# Altium schematic sheet SOLAR_PO.SchDoc
size A2; SheetNumber: 5; SheetTotal: 5
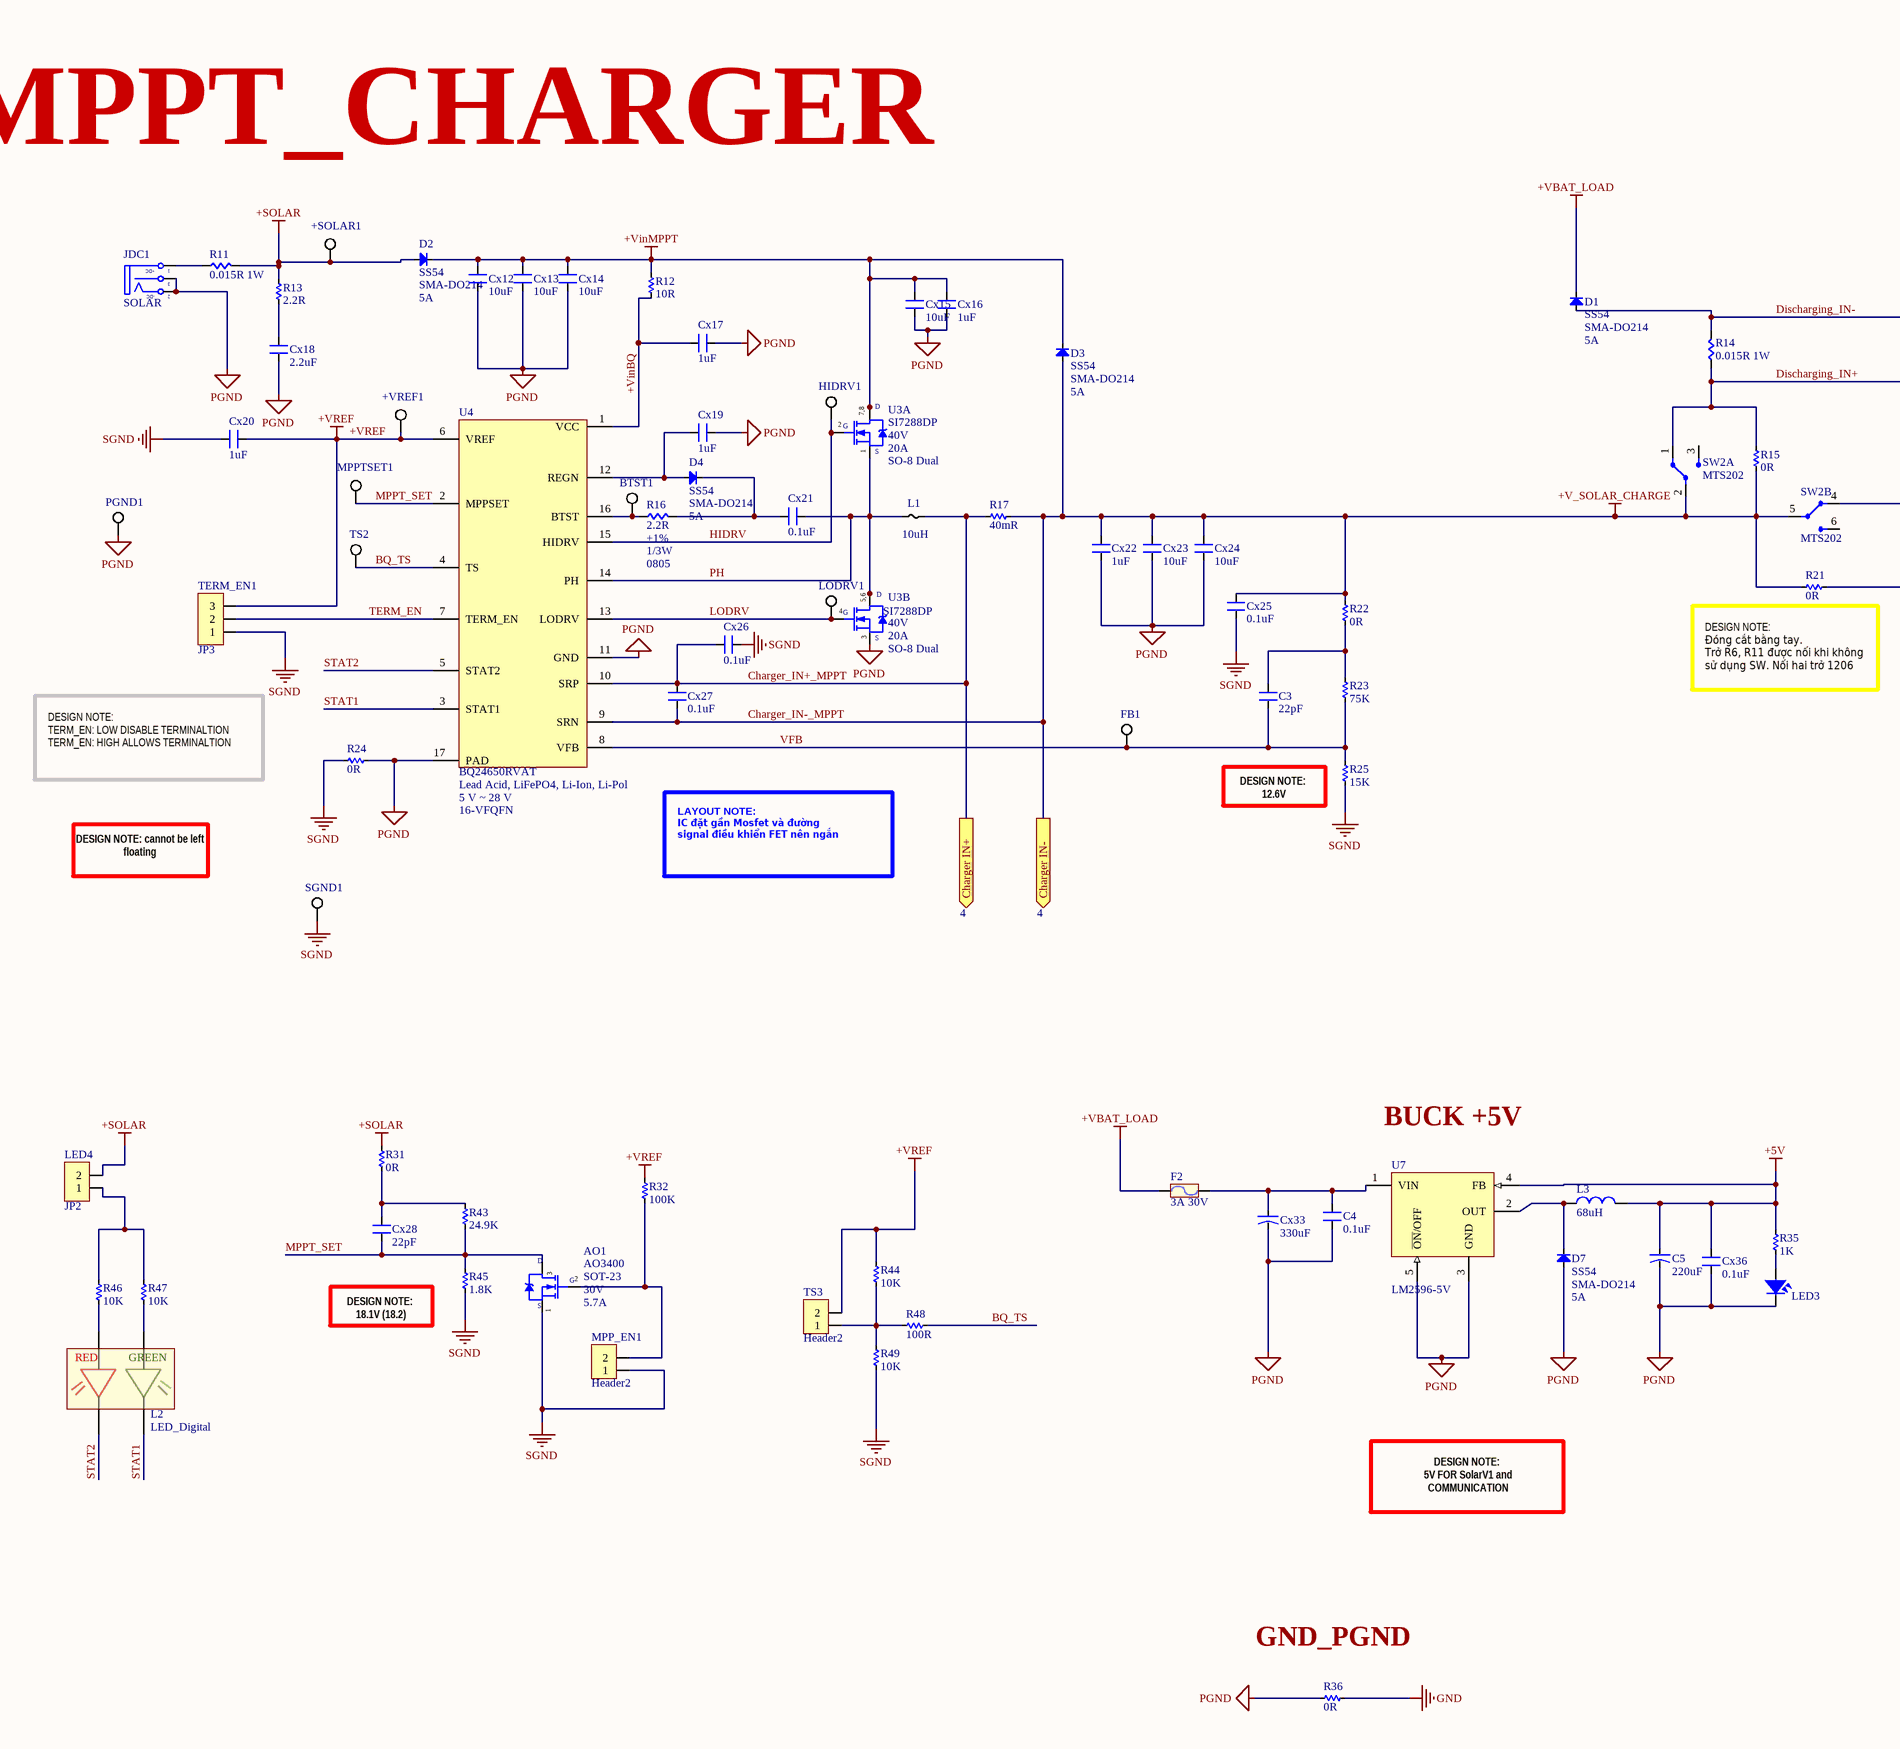
[diagram p0: SOLAR_PO.SchDoc, left]
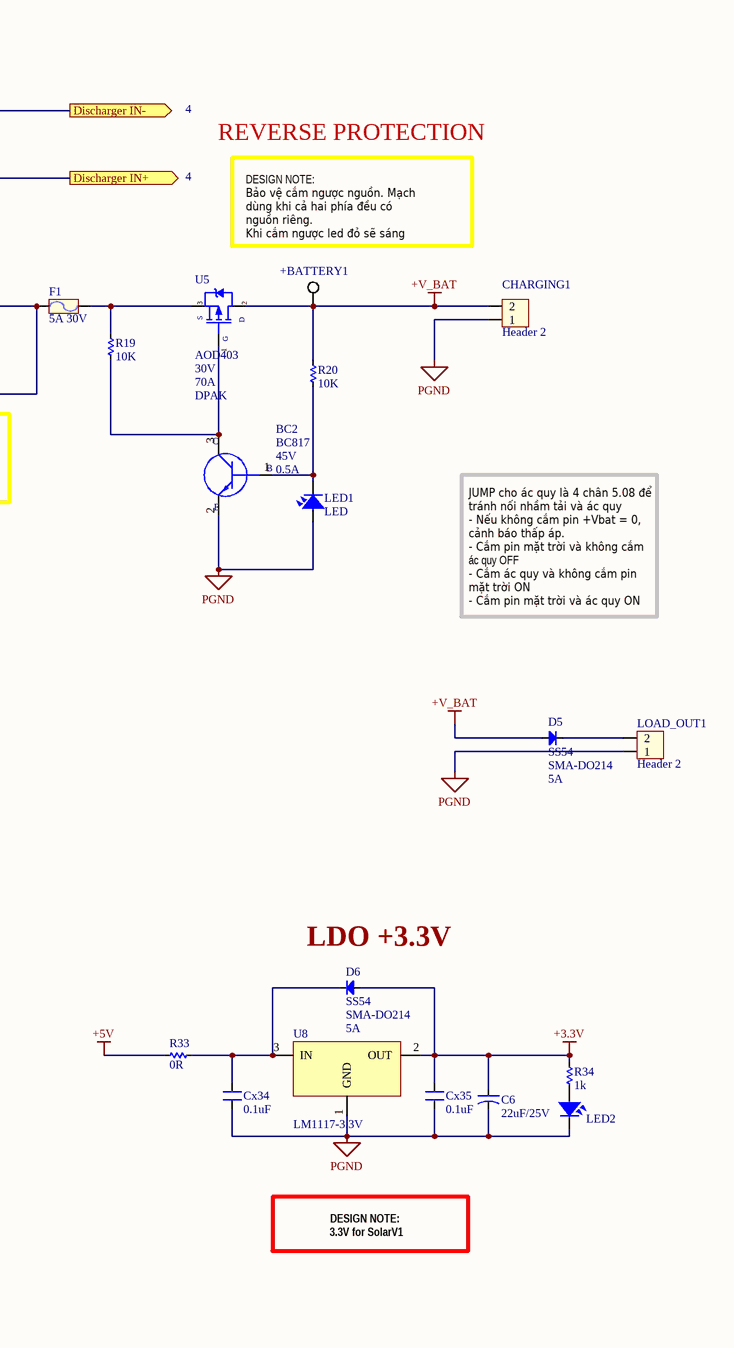
[diagram p1: SOLAR_PO.SchDoc, right]

## Parts
+BATTERY1  TP 2x2mm  [TP 2x2mm]  (value not drawn)
+SOLAR1  TP 2x2mm  [TP 2x2mm]  (value not drawn)
+VREF1  TP 2x2mm  [TP 2x2mm]  (value not drawn)
AO1  AO3400  Package Type: SOT-23  Drain-Source On-Volt: 30V  Continuous Drain Current: 5.7A  [SOT23-231]
BC2  BC817  Voltage: 45V  Current: 0.5A  [SOT23-132]
BTST1  TP 2x2mm  [TP 2x2mm]  (value not drawn)
C3  22pF  [SM-0805]
C4  0.1uF  [SM-0805]
C5  220uF  [CAP-ALU-SMD-F]
C6  22uF/25V  [CAP-ALU-SMD-4.5x5x1.4]
CHARGING1  Header 2  [HED2T]
Cx12  10uF  [CN-SMD-0805]
Cx13  10uF  [CN-SMD-0805]
Cx14  10uF  [CN-SMD-0805]
Cx15  10uF  [CN-SMD-0805]
Cx16  1uF  [CN-SMD-0805]
Cx17  1uF  [CN-SMD-0805]
Cx18  2.2uF  [CN-SMD-0805]
Cx19  1uF  [CN-SMD-0805]
Cx20  1uF  [CN-SMD-0805]
Cx21  0.1uF  [CN-SMD-0805]
Cx22  1uF  [CN-SMD-0805]
Cx23  10uF  [CN-SMD-0805]
Cx24  10uF  [CN-SMD-0805]
Cx25  0.1uF  [CN-SMD-0805]
Cx26  0.1uF  [CN-SMD-0805]
Cx27  0.1uF  [CN-SMD-0805]
Cx28  22pF  [CN-SMD-0805]
Cx33  330uF  [CAP SMD ALU SIZE F]
Cx34  0.1uF  [CN-SMD-0805]
Cx35  0.1uF  [CN-SMD-0805]
Cx36  0.1uF  [CN-SMD-0805]
D1  SS54  Package: SMA-DO214  Current: 5A  [SMA (DO-214AC)]
D2  SS54  Package: SMA-DO214  Current: 5A  [SMA (DO-214AC)]
D3  SS54  Package: SMA-DO214  Current: 5A  [SMA (DO-214AC)]
D4  SS54  Package: SMA-DO214  Current: 5A  [SMA (DO-214AC)]
D5  SS54  Package: SMA-DO214  Current: 5A  [SMA (DO-214AC)]
D6  SS54  Package: SMA-DO214  Current: 5A  [SMA (DO-214AC)]
D7  SS54  Package: SMA-DO214  Current: 5A  [SMA (DO-214AC)]
F1  5A 30V  [CN4]
F2  3A 30V  [CN2-G]
FB1  TP 2x2mm  [TP 2x2mm]  (value not drawn)
HIDRV1  TP 2x2mm  [TP 2x2mm]  (value not drawn)
JDC1  SOLAR  [DC0]
L1  10uH  [CDRH104R]
L2  LED_Digital  [LedDigital]
L3  68uH  [INDUCTOR SMD 12x12X8.5mm]
LED1  LED  [LED-5 GRe]
LED2  LED  [LED-0805-Blue]  (value not drawn)
LED3  LED  [LED-0805-Red]  (value not drawn)
LED4  JP2  [JP2-CLOSED]
LOAD_OUT1  Header 2  [HED2T]
LODRV1  TP 2x2mm  [TP 2x2mm]  (value not drawn)
MPP_EN1  Header2  [JP2-D1T]
MPPTSET1  TP 2x2mm  [TP 2x2mm]  (value not drawn)
PGND1  TP 2x2mm  [TP 2x2mm]  (value not drawn)
R11  0.015R 1W  [RES-SMD-2512]
R12  10R  [RES-SMD-0805]
R13  2.2R  [RES-SMD-2512]
R14  0.015R 1W  [RES-SMD-2512]
R15  0R  [RES-SMD-1206]
R16  2.2R  Tolerance: ±1%  Power (Watts): 1/3W  Supplier Device Package: 0805  [RES-SMD-0805]
R17  40mR  [RES-SMD-2512]
R19  10K  [RES-SMD-0805]
R20  10K  [RES-SMD-0805]
R21  0R  [RES-SMD-1206]
R22  0R  [RES-SMD-0805]
R23  75K  [RES-SMD-0805]
R24  0R  [RES-SMD-0805]
R25  15K  [RES-SMD-0805]
R31  0R  [RES-SMD-0805]
R32  100K  [RES-SMD-0805]
R33  0R  [RES-SMD-0805]
R34  1k  [RES-SMD-0805]
R35  1K  [RES-SMD-0805]
R36  0R  [RES-SMD-0805]
R43  24.9K  [RES-SMD-0805]
R44  10K  [RES-SMD-0805]
R45  1.8K  [RES-SMD-0805]
R46  10K  [RES-SMD-0805]
R47  10K  [RES-SMD-0805]
R48  100R  [RES-SMD-0805]
R49  10K  [RES-SMD-0805]
SGND1  TP 2x2mm  [TP 2x2mm]  (value not drawn)
SW2  MTS202  [MTS-20X]  (parts A,B of 2)
TERM_EN1  JP3  [JP3-D1T]
TS2  TP 2x2mm  [TP 2x2mm]  (value not drawn)
TS3  Header2  [JP2-D1T]
U3  SI7288DP  Drain to Source Voltage (Vdss): 40V  Current - Continuous Drain (Id) @ 25°C: 20A  Package / Case: SO-8 Dual  [SO-8 PowerPAK]  (parts A,B of 2)
U4  BQ24650RVAT  Battery Chemistry: Lead Acid, LiFePO4, Li-Ion, Li-Pol  Voltage - Supply: 5 V ~ 28 V  Package / Case: 16-VFQFN  [VFQFN-16-EP]
U5  AOD403  Drain-Source On-Volt: 30V  Continuous Drain Current: 70A  Package Type: DPAK  [TO-252 DPAK]
U7  LM2596-5V  [TO263]
U8  LM1117-3.3V  [SOT223]

## Ports
Charger IN+ (out), Charger IN- (out), Discharger IN+ (out), Discharger IN- (out)

## Nets
+3.3V: C6.1 Cx35.2 D6.1(A) R34.1 U8.2(OUT)
+5V: C5.1 Cx36.2 L3.2 R33.2 R35.1 U7.4(FB)
+SOLAR: +SOLAR1.3 D2.1(A) LED4.2 R11.2 R13.1 R31.1
+V_BAT: +BATTERY1.3 CHARGING1.2 D5.1(A) R20.2 U5.2(D)
+VBAT_LOAD: D1.2(K) F2.1
+VinMPPT: Cx12.2 Cx13.2 Cx14.2 Cx15.2 Cx16.1 D2.2(K) D3.2(K) R12.1 U3.7(D) U3.8(D)
+VREF: +VREF1.3 Cx20.1 R32.1 R44.1 TERM_EN1.3 TS3.2 U4.6(VREF)
Charger_IN-_MPPT: Cx22.1 Cx23.1 Cx24.2 Cx25.1 Cx27.2 D3.1(A) R15.1 R17.1 R21.1 R22.1 SW2.2 SW2.5 U4.9(SRN) ; port Charger IN-  [also labelled +V_SOLAR_CHARGE]
GND: R36.1
PGND: BC2.2(E) C4.1 C5.2 C6.2 CHARGING1.1 Cx12.1 Cx13.1 Cx14.1 Cx15.1 Cx16.2 Cx17.1 Cx18.1 Cx19.1 Cx22.2 Cx23.2 Cx24.1 Cx33.2 Cx34.1 Cx35.1 Cx36.1 D7.1(A) JDC1.2(TN) JDC1.3(S) LED1.1 LED2.2 LED3.2 LOAD_OUT1.1 PGND1.3 R24.1 R36.2 U3.3(S) U4.11(GND) U4.17(PAD) U7.3(GND) U7.5(~{ON}/OFF) U8.1(GND)
SGND: AO1.1(S) Cx20.2 Cx25.2 Cx26.1 MPP_EN1.1 R24.2 R25.2 R45.2 R49.2 SGND1.3 TERM_EN1.1
+VinBQ: Cx17.2 R12.2 U4.1(VCC)
BQ_TS: R48.2 TS2.3 U4.4(TS)
Charger_IN+_MPPT: Cx26.2 Cx27.1 L1.2 R17.2 U4.10(SRP) ; port Charger IN+
Discharging_IN+: R14.1 R15.2 SW2.1 ; port Discharger IN+
Discharging_IN-: D1.1(A) R14.2 ; port Discharger IN-
HIDRV: HIDRV1.3 U3.2(G) U4.15(HIDRV)
LODRV: LODRV1.3 U3.4(G) U4.13(LODRV)
MPPT_SET: AO1.3(D) Cx28.2 MPPTSET1.3 R43.2 R45.1 U4.2(MPPSET)
PH: Cx21.1 L1.1 U3.1(S) U3.5(D) U3.6(D) U4.14(PH)
STAT1: L2.4 U4.3(STAT1)
STAT2: L2.2 U4.5(STAT2)
TERM_EN: TERM_EN1.2 U4.7(TERM_EN)
VFB: C3.1 FB1.3 R23.2 R25.1 U4.8(VFB)
NetAO1_2: AO1.2(G) MPP_EN1.2 R32.2
NetBC2_1: BC2.1(B) LED1.2 R20.1
NetBC2_3: BC2.3(C) R19.1 U5.1(G)
NetBTST1_3: BTST1.3 R16.1 U4.16(BTST)
NetC3_2: C3.2 R22.2 R23.1
NetC4_2: C4.2 Cx33.1 F2.2 U7.1(VIN)
NetCx18_2: Cx18.2 R13.2
NetCx19_2: Cx19.2 D4.1(A) U4.12(REGN)
NetCx21_2: Cx21.2 D4.2(K) R16.2
NetCx28_1: Cx28.1 R31.2 R43.1
NetCx34_2: Cx34.2 D6.2(K) R33.1 U8.3(IN)
NetD5_2: D5.2(K) LOAD_OUT1.2
NetD7_2: D7.2(K) L3.1 U7.2(OUT)
NetF1_1: F1.1 R21.2 SW2.4
NetF1_2: F1.2 R19.2 U5.3(S)
NetJDC1_1: JDC1.1(T) R11.1
NetL2_1: L2.1 R46.2
NetL2_3: L2.3 R47.2
NetLED2_1: LED2.1 R34.2
NetLED3_1: LED3.1 R35.2
NetLED4_1: LED4.1 R46.1 R47.1
NetR44_2: R44.2 R48.1 R49.1 TS3.1

Not connected (* = marked no-connect by the designer): SW2 3(I/O2) 6(I/O2)

## Notes on the sheet
- MPPT_CHARGER
- REVERSE PROTECTION
- DESIGN NOTE:
  Bảo vệ cắm ngược nguồn. Mạch dùng khi cả hai phía đều có nguồn riêng.
  Khi cắm ngược led đỏ sẽ sáng báo cắm trạng thái cắm ngược
- (near R21) DESIGN NOTE:
  Đóng cắt bằng tay.
  Trở R6, R11 được nối khi không sử dụng SW. Nối hai trở 1206
- DESIGN NOTE:
  TERM_EN: LOW DISABLE TERMINALTION
  TERM_EN: HIGH ALLOWS TERMINALTION
- (near R25) DESIGN NOTE:
  12.6V
- JUMP cho ác quy là 4 chân 5.08 để tránh nối nhầm tải và ác quy
  - Nếu không cắm pin +Vbat = 0, cảnh báo thấp áp.
  - Cắm pin mặt trời và không cắm ác quy OFF
  - Cắm ác quy và không cắm pin mặt trời ON
  - Cắm pin mặt trời và ác quy ON
- DESIGN NOTE: cannot be left floating
- LAYOUT NOTE:
  IC đặt gần Mosfet và đường signal điều khiển FET nên ngắn
- (near D6) LDO +3.3V
- BUCK +5V
- (near R45) DESIGN NOTE:
  18.1V (18.2)
- DESIGN NOTE:
  3.3V for SolarV1
- DESIGN NOTE:
  5V FOR SolarV1 and COMMUNICATION
- (near R36) GND_PGND
- (in symbol DCIN) +DC; -DC
- (in symbol FET SI7288DP-T1-GE3, part A) 7,8
- (in symbol FET SI7288DP-T1-GE3, part B) 5,6
- (in symbol LED_Digital) RED; GREEN

## Library data of the parts
AO1 = FET N-CH 4A 30V AO3400A: MOSFET N-CH 30V 5.7A SOT23; Manufacturer: Alpha & Omega Semiconductor; Number of  Elements: 1; Polarity: N; Channel Mode: Enhancement; Drain-Source On-Res: 0.0265Ohm; Gate-Source Voltage (Max): ±12V; Power Dissipation: 1.4W; Supplier 1: LCSC; Manufacturer Part Number: AO3400A; Stock 1: 497680; Pricing 1: 5=0.1102, 50=0.0812, 150=0.0759, 500=0.0706, 2500=0.0682, 5000=0.0671, 5=0.0989, 50=0.0729, 150=0.0681, 500=0.0633, 2500=0.0612, 5000=0.0602, 5=0.5285, 50=0.3893, 150=0.3638, 500=0.3384, 2500=0.3271, 5000=0.3215, 5=0.5065, 50=0.3731, 150=0.3487, 500=0.3244, 2500=0.3135, 5000=0.3081, 5=0.0678, 50=0.05, 150=0.0467, 500=0.0434, 2500=0.042, 5000=0.0413, 5=0.0593, 50=0.0437, 150=0.0408, 500=0.038, 2500=0.0367, 5000=0.0361, 5=0.5868, 50=0.4323, 150=0.404, 500=0.3758, 2500=0.3632, 5000=0.357, 5=8.1047, 50=5.9701, 150=5.5801, 500=5.19, 2500=5.0167, 5000=4.93, 5=0.3132, 50=0.2307, 150=0.2156, 500=0.2005, 2500=0.1938, 5000=0.1905, 5=4.8106, 50=3.5436, 150=3.3121, 500=3.0806, 2500=2.9777, 5000=2.9262, 5=0.7344, 50=0.541, 150=0.5056, 500=0.4703, 2500=0.4546, 5000=0.4467, 5=0.1024, 50=0.0754, 150=0.0705, 500=0.0656, 2500=0.0634, 5000=0.0623, 5=0.0748, 50=0.0551, 150=0.0515, 500=0.0479, 2500=0.0463, 5000=0.0455 (AUD); Type: Power MOSFET; Operating Temp Range: -55C to 150C; Operating Temperature Classification: Military; Mounting: Surface Mount; Pin Count: 3; ComponentLink1URL: http://aosmd.com/res/packaging_information/SOT-23-3L.pdf?src-supplier=Digi-Key; ComponentLink1Description: http://aosmd.com/res/packaging_information/SOT-23-3L.pdf?src-supplier=Digi-Key; ComponentLink2URL: https://www.verical.com/server-webapp/html/getDatasheet?partID=64438&src-supplier=Verical; ComponentLink2Description: https://www.verical.com/server-webapp/html/getDatasheet?partID=64438&src-supplier=Verical; Supplier Part Number 1: C20917
BC2 = TRAN 0.5A 45V BC817-25,215 SOT23 VN: BC817 Series 45 V 500 mA SMT NPN General Purpose Transistor - SOT-23 VN; Manufacturer: Nexperia; Supplier 1: Rochester Electronics; Manufacturer Part Number: BC817-25,215; Stock 1: 5904000; Pricing 1: 1=0.03, 25=0.03, 100=0.03, 500=0.03, 1000=0.03 (USD); ComponentLink1URL: http://www.farnell.com/datasheets/699988.pdf?src-supplier=Farnell; ComponentLink1Description: http://www.farnell.com/datasheets/699988.pdf?src-supplier=Farnell; ComponentLink2URL: http://www.farnell.com/datasheets/699988.pdf?src-supplier=Newark; ComponentLink2Description: http://www.farnell.com/datasheets/699988.pdf?src-supplier=Newark; ComponentLink3URL: https://www.mouser.com/ds/2/302/BC817_BC817W_BC337-188983.pdf?src-supplier=Mouser; ComponentLink3Description: https://www.mouser.com/ds/2/302/BC817_BC817W_BC337-188983.pdf?src-supplier=Mouser; ComponentLink4URL: https://assets.nexperia.com/documents/data-sheet/BC817_SER.pdf?src-supplier=Digi-Key; ComponentLink4Description: https://assets.nexperia.com/documents/data-sheet/BC817_SER.pdf?src-supplier=Digi-Key; Supplier Part Number 1: BC817-25,215
C3 = CM: Cap Ceramic 22pF 50V C0G 10% Pad SMD 0805 125°C T/R; Value: 103
C4 = CM: Cap SMD; Value: 103
C5 C6 Cx33 = CN-ALU-SMD: Polarized Capacitor (Axial); Published: 8-Jun-2000; LatestRevisionDate: 17-Jul-2002; LatestRevisionNote: Re-released for DXP Platform.; PackageReference: POLAR0.8; Publisher: Altium Limited
CHARGING1 LOAD_OUT1 = Hed2: Header 2 (Green); Value: Header 2
Cx12-Cx28 Cx34-Cx36 = CN: Value: 33pF
D1-D7 = DIODE 5A 40V SS54  Schottky Diode VN: SS54 SMA/DO-124AC 5A 40V Schottky Barrier (1N5824) VN
F1 = FUSR 4A 30V DIP
F2 = FUSE 4A 30V DIP
JDC1 = DCIN: Jac DC input; Value: Jac DC
L1 = inductor: CDRH104,104R
L2 = LED_Digital: DBL2
L3 = IND 33UH 3A CDRH127NP-330MC: FIXED IND 33UH 3A 64.8 MOHM SMD; Manufacturer: Sumida; Product Training Modules: Power Inductor Basics; Catalog Drawings: CDRH127 Series Front CDRH127 Series Side CDRH127 Series Bottom; Inductance: 33µH; Tolerance: ±20%; Shielding: Shielded; DC Resistance (DCR): 64.8 mOhm Max; Frequency - Test: 1kHz; Online Catalog: CDRH Series; Other Names: 308-1467-1; Supplier 1: Mouser; Manufacturer Part Number: CDRH127NP-330MC; Stock 1: 1471; Pricing 1: 1=2.03, 10=1.53, 50=1.53, 100=1.4, 500=0.918, 1000=0.837, 2500=0.81, 5000=0.783, 10000=0.756, 25000=0.718 (USD); Standard Package: 1; Category: Inductors, Coils, Chokes; Family: Fixed Inductors; Series: CDRH127; Packaging: Cut Tape (CT); Type: -; Material - Core: -; Current Rating: 3A; Current - Saturation: -; Q @ Freq: -; Frequency - Self Resonant: -; Ratings: -; Operating Temperature: -40°C ~ 100°C; Mounting Type: Surface Mount; Package / Case: Nonstandard; Size / Dimension: 0.472" L x 0.472" W (12.00mm x 12.00mm); Height - Seated (Max): 0.315" (8.00mm); ComponentLink1URL: http://www.sumida.com/products/pdf/CDRH127.pdf?src-supplier=Avnet; ComponentLink1Description: http://www.sumida.com/products/pdf/CDRH127.pdf?src-supplier=Avnet; ComponentLink2URL: https://www.verical.com/server-webapp/html/getDatasheet?partID=353985&src-supplier=Verical; ComponentLink2Description: https://www.verical.com/server-webapp/html/getDatasheet?partID=353985&src-supplier=Verical; ComponentLink3URL: http://components.arrow.com/part/dataview/51004637S8883439N4456?src-supplier=Arrow; ComponentLink3Description: http://components.arrow.com/part/dataview/51004637S8883439N4456?src-supplier=Arrow; ComponentLink4URL: http://products.sumida.com/products/pdf/CDRH127.pdf?src-supplier=Digi-Key; ComponentLink4Description: http://products.sumida.com/products/pdf/CDRH127.pdf?src-supplier=Digi-Key; ComponentLink5URL: http://www.sumida.com/products/pdf/CDRH127,127LD.pdf?src-supplier=Future+Electronics; ComponentLink5Description: http://www.sumida.com/products/pdf/CDRH127,127LD.pdf?src-supplier=Future+Electronics; ComponentLink6URL: http://www.sumida.com/products/pdf/CDRH127.pdf?src-supplier=Mouser; ComponentLink6Description: http://www.sumida.com/products/pdf/CDRH127.pdf?src-supplier=Mouser; Supplier Part Number 1: 851-CDRH127NP-330MC
LED1 = LED: LED Single colour Green and Red; Value: LED 3 ly Single Colour
LED2 LED3 = LED SMD: Value: LED 3 - 5 ly 2 Colour
LED4 = JP2: WR-PHD 2.54 mm Angled Socket Header; Manufacturer: W¨¹rth Elektronik eiSos GmbH; partNo: 613002143121; ComponentLink1 Description: Manufacturer; ComponentLink2 Description: Datasheet; NoPins: 02; Created Date: 29 March 2013; ComponentLink1URL: http://www.we-online.com; ComponentLink2URL: http://katalog.we-online.de/em/datasheet/6130xx143121.pdf; Created by: Karrer Zheng
MPP_EN1 TS3 = Header2: Header IDC, 2 x 1 Pin Vertical 2.54mm Pitch (Non-Boxed, Male); Manufacturer: W¨¹rth Elektronik eiSos GmbH; partNo: 613002143121; ComponentLink1 Description: Manufacturer; ComponentLink2 Description: Datasheet; NoPins: 02; Created Date: 29 March 2013; ComponentLink1URL: http://www.we-online.com; ComponentLink2URL: http://katalog.we-online.de/em/datasheet/6130xx143121.pdf; Created by: Karrer Zheng
R11 R14 = RES 0.015R 2512 1W 1%: RES SMD 15 MOHM 1% 1W 2512; Manufacturer: Vishay Dale; Manufacturer Part Number: WSL2512R0150FEA; Resistance: 0.015ohm; Resistor Case Style: 2512 [6432 Metric]; Product Range: WSL Series; Resistor Element Type: Metal Strip; Temperature Coefficient: ± 75ppm/°C; Automotive Qualification Standard: AEC-Q200; SVHC: No SVHC (15-Jun-2015); Supplier 1: Mouser; Stock 1: 10348; Pricing 1: 1=1.16, 10=1.16, 25=0.973, 50=0.973, 100=0.842, 250=0.711, 500=0.599, 1000=0.5, 10000=0.5 (USD); Power Rating: 1W; Resistance Tolerance: ± 1%; Packaging: Cut Tape; MSL: MSL 1 - Unlimited; ComponentLink1URL: http://www.vishay.com/docs/30100/wsl.pdf?src-supplier=Digi-Key; ComponentLink1Description: http://www.vishay.com/docs/30100/wsl.pdf?src-supplier=Digi-Key; ComponentLink2URL: http://www.vishay.com/docs/30100/wsl.pdf?src-supplier=Future+Electronics; ComponentLink2Description: http://www.vishay.com/docs/30100/wsl.pdf?src-supplier=Future+Electronics; ComponentLink3URL: https://www.alliedelec.com/m/d/b482c23d27c9fba0eb82e9503f73d2f9.pdf?src-supplier=Allied+Electronics; ComponentLink3Description: https://www.alliedelec.com/m/d/b482c23d27c9fba0eb82e9503f73d2f9.pdf?src-supplier=Allied+Electronics; ComponentLink4URL: http://www.mouser.com/ds/2/427/wsl-101914.pdf?src-supplier=Mouser; ComponentLink4Description: http://www.mouser.com/ds/2/427/wsl-101914.pdf?src-supplier=Mouser; ComponentLink5URL: http://www.vishay.com/docs/30100/wsl.pdf?src-supplier=Farnell; ComponentLink5Description: http://www.vishay.com/docs/30100/wsl.pdf?src-supplier=Farnell; ComponentLink6URL: http://www.farnell.com/datasheets/2049120.pdf?src-supplier=Element14; ComponentLink6Description: http://www.farnell.com/datasheets/2049120.pdf?src-supplier=Element14; ComponentLink7URL: http://www.vishay.com/docs/30100/wsl.pdf?src-supplier=Avnet; ComponentLink7Description: http://www.vishay.com/docs/30100/wsl.pdf?src-supplier=Avnet; ComponentLink8URL: https://www.verical.com/server-webapp/html/getDatasheet?partID=117037&src-supplier=Verical; ComponentLink8Description: https://www.verical.com/server-webapp/html/getDatasheet?partID=117037&src-supplier=Verical; ComponentLink9URL: http://www.vishay.com/docs/30100/wsl.pdf?src-supplier=Avnet+Europe; ComponentLink9Description: http://www.vishay.com/docs/30100/wsl.pdf?src-supplier=Avnet+Europe; ComponentLink10URL: http://www.vishay.com/docs/30100/wsl.pdf?src-supplier=Element14; ComponentLink10Description: http://www.vishay.com/docs/30100/wsl.pdf?src-supplier=Element14; ComponentLink11URL: http://uk.rs-online.com/webdocs/0d81/0900766b80d81e3e.pdf?src-supplier=RSComponents; ComponentLink11Description: http://uk.rs-online.com/webdocs/0d81/0900766b80d81e3e.pdf?src-supplier=RSComponents; Supplier Part Number 1: 71-WSL2512R0150FEA
R12 = Res-SMD: 0805; Manufacturer: Generic Components; Class: Passive; Published: 08/06/2000; Publisher: Altium Hobart Technology Centre
R13 R15 R17 R19-R25 R31-R36 R43-R49 = Res-SMD: Resistor; Manufacturer: Generic Components; Class: Passive; Published: 08/06/2000; Publisher: Altium Hobart Technology Centre
R16 = RES 2.2R 1% 0805 RL1220S-2R2-F VN: RES SMD 2.2 OHM 1% 1/3W 0805 VN; Manufacturer: Susumu; Product Training Modules: RL Current Sense Resistors; Featured Product: RL Series - Low Resistance Current Sensors; EDA / CAD Models: Download from Accelerated Designs; Resistance (Ohms): 2.2; Temperature Coefficient: 0/ +200ppm/°C; Online Catalog: RL Series; Kits: RL1220SF-1-KIT-ND  - RESISTOR KIT 0.1-10 1/3W 480PCS; Other Names: RL12S2.20FCT; Supplier 1: Mouser; Manufacturer Part Number: RL1220S-2R2-F; Stock 1: 7219; Pricing 1: 1=0.39, 10=0.24, 50=0.24, 100=0.133, 500=0.083, 1000=0.06, 2500=0.051, 5000=0.047, 10000=0.038, 25000=0.036 (USD); RoHS Information: Cert of RoHS Compliance; Standard Package: 1; Category: Resistors; Family: Chip Resistor - Surface Mount; Series: RL; Packaging: Cut Tape (CT); Composition: Thin Film; Features: Current Sense; Operating Temperature: -55°C ~ 125°C; Package / Case: 0805 (2012 Metric); Size / Dimension: 0.079" L x 0.049" W (2.00mm x 1.25mm); Height: 0.020" (0.50mm); Number of Terminations: 2; ComponentLink1URL: http://www.susumu-usa.com/pdf/Foot_Print_19.pdf?src-supplier=Digi-Key; ComponentLink1Description: http://www.susumu-usa.com/pdf/Foot_Print_19.pdf?src-supplier=Digi-Key; ComponentLink2URL: http://www.susumu.co.jp/common/pdf/n_catalog_partition08_en.pdf?src-supplier=Digi-Key; ComponentLink2Description: http://www.susumu.co.jp/common/pdf/n_catalog_partition08_en.pdf?src-supplier=Digi-Key; Supplier Part Number 1: 754-RL1220S-2R2-F
SW2 = SW MTS202 ON-ON
TERM_EN1 = JP3: WR-PHD 2.54 mm Angled Socket Header; Manufacturer: W¨¹rth Elektronik eiSos GmbH; partNo: 613003143121; ComponentLink1 Description: Manufacturer; ComponentLink2 Description: Datasheet; NoPins: 03; Created Date: 29 March 2013; ComponentLink1URL: http://www.we-online.com; ComponentLink2URL: http://katalog.we-online.de/em/datasheet/6130xx143121.pdf; Created by: Karrer Zheng
U3 = FET SI7288DP-T1-GE3: MOSFET 2N-CH 40V 20A PPAK SO-8; Manufacturer: Vishay Siliconix; PCN Assembly/Origin: Multiple Fabracation Changes09/Jul/2014; FET Type: 2 N-Channel (Dual); FET Feature: Standard; Rds On (Max) @ Id, Vgs: 19 mOhm @ 10A, 10V; Vgs(th) (Max) @ Id: 2.8V @ 250µA; Gate Charge (Qg) @ Vgs: 15nC @ 10V; Input Capacitance (Ciss) @ Vds: 565pF @ 20V; Power - Max: 15.6W; Online Catalog: N-Channel Standard FETs; Other Names: SI7288DP-T1-GE3DKR; Supplier 1: Mouser; Manufacturer Part Number: SI7288DP-T1-GE3; Stock 1: 27404; Pricing 1: 1=1.39, 10=1.17, 50=1.17, 100=0.96, 1000=0.679, 10000=0.563 (USD); Standard Package: 1; Category: Discrete Semiconductor Products; Family: FETs - Arrays; Series: TrenchFET®; Packaging: Digi-Reel®; Mounting Type: Surface Mount; Supplier Device Package: PowerPAK® SO-8 Dual; ComponentLink1URL: http://www.vishay.com/docs/65366/si7288dp.pdf?src-supplier=Digi-Key; ComponentLink1Description: http://www.vishay.com/docs/65366/si7288dp.pdf?src-supplier=Digi-Key; ComponentLink2URL: http://www.mouser.com/ds/2/427/si7288dp-244449.pdf?src-supplier=Mouser; ComponentLink2Description: http://www.mouser.com/ds/2/427/si7288dp-244449.pdf?src-supplier=Mouser; ComponentLink3URL: http://www.vishay.com/docs/65366/si7288dp.pdf?src-supplier=Avnet; ComponentLink3Description: http://www.vishay.com/docs/65366/si7288dp.pdf?src-supplier=Avnet; ComponentLink4URL: http://www.vishay.com/docs/65366/si7288dp.pdf?src-supplier=Avnet+Europe; ComponentLink4Description: http://www.vishay.com/docs/65366/si7288dp.pdf?src-supplier=Avnet+Europe; ComponentLink5URL: http://www.vishay.com/docs/65366/si7288dp.pdf?src-supplier=Future+Electronics; ComponentLink5Description: http://www.vishay.com/docs/65366/si7288dp.pdf?src-supplier=Future+Electronics; Supplier Part Number 1: 781-SI7288DP-T1-GE3
U4 = BQ24650RVAT: TEXAS INSTRUMENTS         BQ24650RVAT            IC, BATT CHARGER, LI-ION, 10A, VQFN-16; Product Training Modules: Power Management for Energy Harvesting; Featured Product: bq24650 Battery Charge Controller for Solar Power; Reference Design Library: BQ24650EVM-639: 5 ~ 28V, 8 A Solar Charger; Function: Charge Management, Solar; Dynamic Catalog: Charge Management, Specialized; For Use With: 296-28320-ND / - EVAL MODULE FOR BQ24650; Other Names: 296-27699-6; Supplier 1: Mouser; Manufacturer: Texas Instruments; Manufacturer Part Number: BQ24650RVAT; Stock 1: 1648; Pricing 1: 1=5.36, 10=4.82, 50=4.82, 100=3.94, 1000=2.83, 10000=2.69 (USD); Standard Package: 1; Category: Integrated Circuits (ICs); Family: PMIC - Battery Management; Series: -; Operating Temperature: -40°C ~ 85°C; Mounting Type: Surface Mount; Supplier Device Package: 16-VQFN Exposed Pad (3.5x3.5); Packaging: Digi-Reel®; ComponentLink1URL: http://www.ti.com/general/docs/lit/getliterature.tsp?genericPartNumber=BQ24650&amp;&amp;fileType=pdf&src-supplier=Avnet; ComponentLink1Description: http://www.ti.com/general/docs/lit/getliterature.tsp?genericPartNumber=BQ24650&amp;&amp;fileType=pdf&src-supplier=Avnet; ComponentLink2URL: http://www.ti.com/general/docs/lit/getliterature.tsp?genericPartNumber=BQ24650&amp;&amp;fileType=pdf&src-supplier=Verical; ComponentLink2Description: http://www.ti.com/general/docs/lit/getliterature.tsp?genericPartNumber=BQ24650&amp;&amp;fileType=pdf&src-supplier=Verical; ComponentLink3URL: http://www.ti.com/general/docs/lit/getliterature.tsp?genericPartNumber=BQ24650&amp;&amp;fileType=pdf&src-supplier=Farnell; ComponentLink3Description: http://www.ti.com/general/docs/lit/getliterature.tsp?genericPartNumber=BQ24650&amp;&amp;fileType=pdf&src-supplier=Farnell; ComponentLink4URL: http://www.ti.com/general/docs/lit/getliterature.tsp?genericPartNumber=BQ24650&amp;&amp;fileType=pdf&src-supplier=Mouser; ComponentLink4Description: http://www.ti.com/general/docs/lit/getliterature.tsp?genericPartNumber=BQ24650&amp;&amp;fileType=pdf&src-supplier=Mouser; ComponentLink5URL: http://www.ti.com/general/docs/lit/getliterature.tsp?genericPartNumber=BQ24650&&fileType=pdf&src-supplier=Element14; ComponentLink5Description: http://www.ti.com/general/docs/lit/getliterature.tsp?genericPartNumber=BQ24650&&fileType=pdf&src-supplier=Element14; ComponentLink6URL: http://www.farnell.com/datasheets/1795899.pdf?src-supplier=Element14; ComponentLink6Description: http://www.farnell.com/datasheets/1795899.pdf?src-supplier=Element14; ComponentLink7URL: http://www.ti.com/lit/ds/symlink/bq24650.pdf?src-supplier=Digi-Key; ComponentLink7Description: http://www.ti.com/lit/ds/symlink/bq24650.pdf?src-supplier=Digi-Key; ComponentLink8URL: http://www.ti.com/general/docs/lit/getliterature.tsp?genericPartNumber=BQ24650&amp;&amp;fileType=pdf&src-supplier=Avnet+Europe; ComponentLink8Description: http://www.ti.com/general/docs/lit/getliterature.tsp?genericPartNumber=BQ24650&amp;&amp;fileType=pdf&src-supplier=Avnet+Europe; ComponentLink9URL: http://www.produktinfo.conrad.com/datenblaetter/1000000-1099999/001013519-da-01-en-IC_SYNC_SW_MODE_BQ24650RVAT_VQFN_16_TID.pdf?src-supplier=Conrad; ComponentLink9Description: http://www.produktinfo.conrad.com/datenblaetter/1000000-1099999/001013519-da-01-en-IC_SYNC_SW_MODE_BQ24650RVAT_VQFN_16_TID.pdf?src-supplier=Conrad; Supplier Part Number 1: 595-BQ24650RVAT
U5 = FET P-CH 70A 40V AOD403 VN: Trans MOSFET P-CH 30V 70A 3-Pin(2+Tab) DPAK VN; Manufacturer: Alpha & Omega Semiconductor; Number of  Elements: 1; Polarity: P; Channel Mode: Enhancement; Gate-Source Voltage (Max): ±25V; Power Dissipation: 90W; Supplier 1: Verical; Manufacturer Part Number: AOD403; Stock 1: 160042; Pricing 1: 2500=0.3969, 5000=0.378, 26=0.805 (USD); Type: Power MOSFET; Operating Temp Range: -55C to 175C; Operating Temperature Classification: Military; Mounting: Surface Mount; Pin Count: 2 +Tab; ComponentLink1URL: http://www.aosmd.com/res/packaging_information/TO252.pdf?src-supplier=Digi-Key; ComponentLink1Description: http://www.aosmd.com/res/packaging_information/TO252.pdf?src-supplier=Digi-Key; ComponentLink2URL: https://www.verical.com/server-webapp/html/getDatasheet?partID=313226&src-supplier=Verical; ComponentLink2Description: https://www.verical.com/server-webapp/html/getDatasheet?partID=313226&src-supplier=Verical; Supplier Part Number 1: AOD403
U7 = BUCK 5V LM2596SX-5.0/NOPB: IC REG BUCK 5V 3A TO263-5; Manufacturer: Texas Instruments; Categories: Integrated Circuits (ICs); Function: Step-Down; Output Configuration: Positive; Output Type: Fixed; Number of Outputs: 1; Voltage - Input (Min): 4.5V; Voltage - Input (Max): 40V; Frequency - Switching: 150kHz; Synchronous Rectifier: No; Supplier 1: Newark; Manufacturer Part Number: LM2596SX-5.0/NOPB; Stock 1: 1924; Pricing 1: 1=4.77, 10=4.28, 25=4.02, 50=3.77, 100=3.51, 250=3.29 (USD); Series: SIMPLE SWITCHER®; Packaging: Digi-Reel®; Part Status: Active; Topology: Buck; Voltage - Output (Min/Fixed): 5V; Voltage - Output (Max): -; Current - Output: 3A; Operating Temperature: -40°C ~ 125°C (TJ); Mounting Type: Surface Mount; Package / Case: TO-263-6, D²Pak (5 Leads + Tab), TO-263BA; Supplier Device Package: DDPAK/TO-263-5; Base Part Number: LM2596; Supplier Part Number 1: 28AH3161
U8 = LM1117: 800mA Low-Dropout Linear Regulator; Creator: Nguyen Ba Bien; Website: http://group3i.net